# Altium schematic sheet Y9A-07-1517.SchDoc
size A4
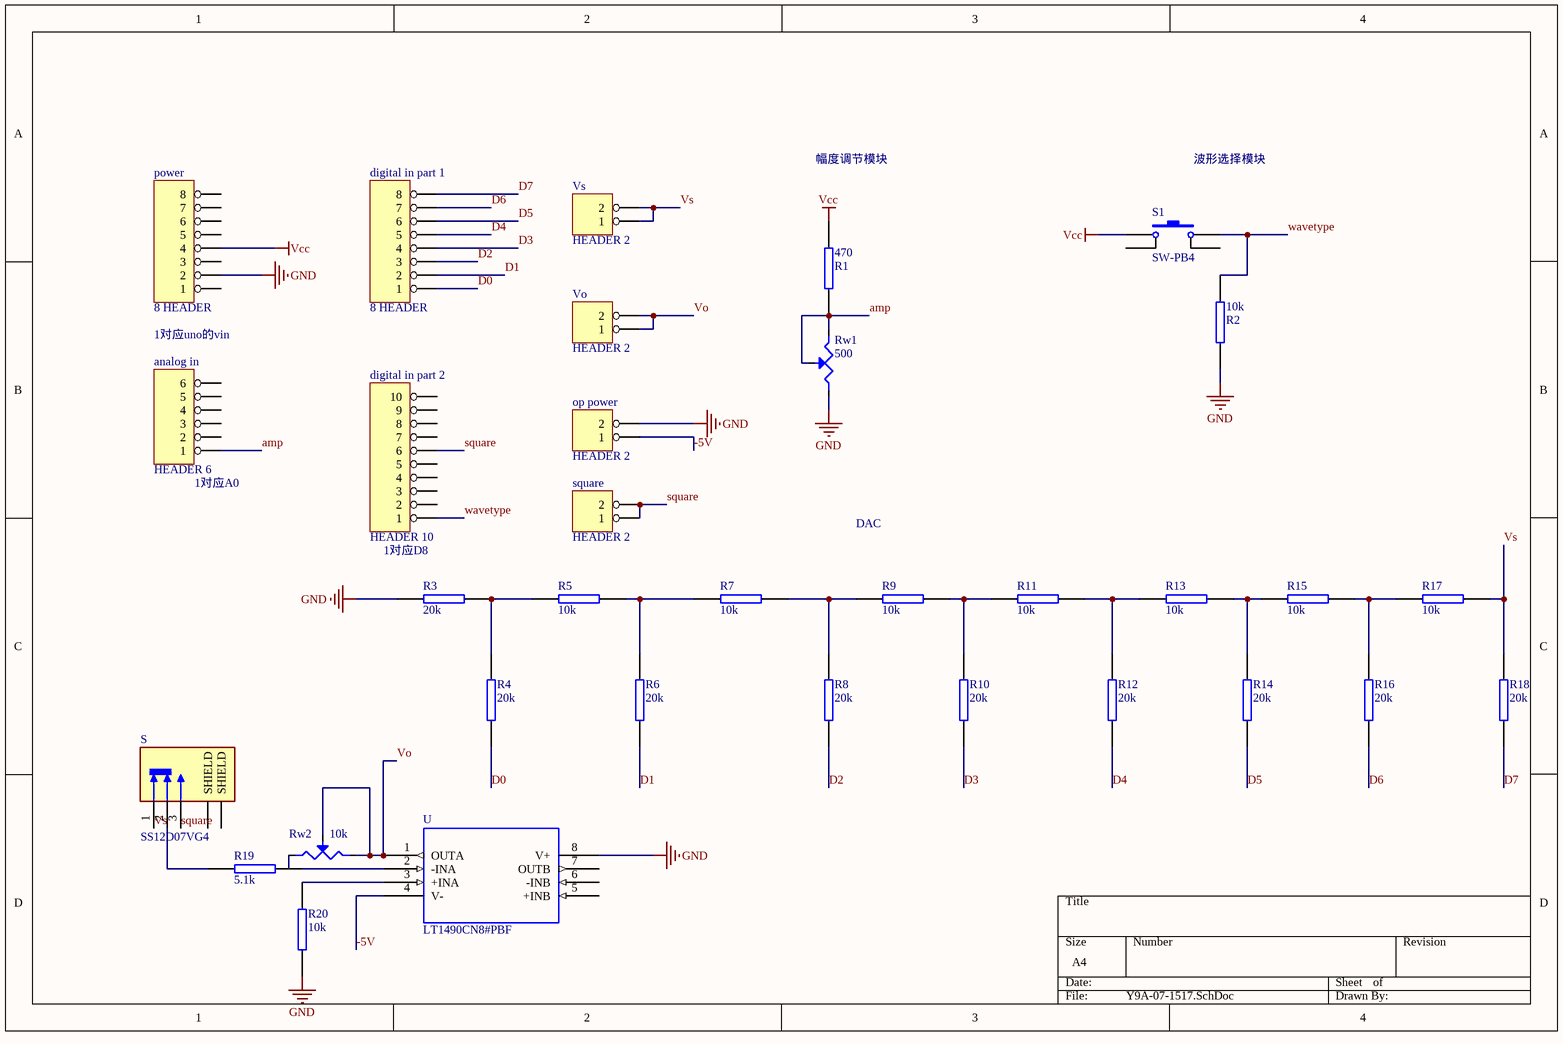
[diagram p0: Y9A-07-1517.SchDoc]

## Parts
10k  R2  [AXIAL-0.4]
470  R1  [AXIAL-0.4]
analog_in  HEADER 6  [SIP6]
digital_in_part_1  8 HEADER  [SIP8]
digital_in_part_2  HEADER 10  [SIP10]
op_power  HEADER 2  [POWER PLUG2]
power  8 HEADER  [SIP8]
R3  20k  [AXIAL-0.4]
R4  20k  [AXIAL-0.4]
R5  10k  [AXIAL-0.4]
R6  20k  [AXIAL-0.4]
R7  10k  [AXIAL-0.4]
R8  20k  [AXIAL-0.4]
R9  10k  [AXIAL-0.4]
R10  20k  [AXIAL-0.4]
R11  10k  [AXIAL-0.4]
R12  20k  [AXIAL-0.4]
R13  10k  [AXIAL-0.4]
R14  20k  [AXIAL-0.4]
R15  10k  [AXIAL-0.4]
R16  20k  [AXIAL-0.4]
R17  10k  [AXIAL-0.4]
R18  20k  [AXIAL-0.4]
R19  5.1k  [AXIAL-0.4]
R20  10k  [AXIAL-0.4]
Rw1  500  [VR5]
Rw2  10k  [VR5]
S  SS12D07VG4  [SW_SS12D07VG4]
S1  SW-PB4  [AN-S]
square  HEADER 2  [SIP-2]
U  LT1490CN8#PBF  [PDIP-8_N]
Vo  HEADER 2  [SIP-2]
Vs  HEADER 2  [SIP-2]

## Nets
GND: 10k.1 op_power.2 power.2 R3.1 R20.1 Rw1.1 U.8(V+)
Vcc: 470.2 power.4 S1.1
-5V: op_power.1 U.4(V-)
amp: 470.1 analog_in.1 Rw1.2 Rw1.3(W)
D0: digital_in_part_1.1 R4.1
D1: digital_in_part_1.2 R6.1
D2: digital_in_part_1.3 R8.1
D3: digital_in_part_1.4 R10.1
D4: digital_in_part_1.5 R12.1
D5: digital_in_part_1.6 R14.1
D6: digital_in_part_1.7 R16.1
D7: digital_in_part_1.8 R18.1
square: digital_in_part_2.6 S.3 square.1 square.2
Vo: Rw2.2 Rw2.3(W) U.1(OUTA) Vo.1 Vo.2
Vs: R17.2 R18.2 S.1 Vs.1 Vs.2
wavetype: 10k.2 digital_in_part_2.1 S1.2
NetR3_2: R3.2 R4.2 R5.1
NetR5_2: R5.2 R6.2 R7.1
NetR7_2: R7.2 R8.2 R9.1
NetR9_2: R9.2 R10.2 R11.1
NetR11_2: R11.2 R12.2 R13.1
NetR13_2: R13.2 R14.2 R15.1
NetR15_2: R15.2 R16.2 R17.1
NetR19_1: R19.1 S.2
NetR19_2: R19.2 U.2(-INA)
NetR20_2: R20.2 U.3(+INA)

Not connected (* = marked no-connect by the designer): analog_in 2 3 4 5 6; digital_in_part_2 2 3 4 5 7 8 9 10; power 1 3 5 6 7 8; Rw2 1; S S1(SHIELD) S2(SHIELD); S1 3 4; U 5(+INB) 6(-INB) 7(OUTB)

## Notes on the sheet
- 幅度调节模块
- 波形选择模块
- 1对应uno的vin
- (near analog_in) 1对应A0
- 1对应D8
- DAC

## Library data of the parts
10k R3-R20 = RES2
470 = RES2: value: 470
digital_in_part_1 power = HEADER 8: 8 Pin Header
Rw1 Rw2 = POT1: Potentiometer
S = SS12D07VG4: Switch Slide ON ON SPDT Top Slide 0.3A 30VDC PC Pins Bracket Mount/Through Hole Automotive Bulk; MF: Shouhan; SnapEDA_Link: https://www.snapeda.com/parts/SS12D07VG4/Shouhan/view-part/?ref=snap; Package: Package; Value: *; MP: SS12D07VG4; Check_prices: https://www.snapeda.com/parts/SS12D07VG4/Shouhan/view-part/?ref=eda
S1 = SW-PB4: 微动开关; Published: 24-Mar-1999; LatestRevisionDate: 17-Jul-2002; LatestRevisionNote: Re-released for DXP Platform.; PackageReference: SPST-2; Publisher: Altium Limited
U = LT1490CN8#PBF: Standard (General Purpose) Amplifier 2 Circuit Rail-to-Rail 8-PDIP; MF: Analog Devices; SnapEDA_Link: https://www.snapeda.com/parts/LT1490CN8%23PBF/Analog+Devices/view-part/?ref=snap; Package: PDIP-8 Linear Technology; Value: *; MP: LT1490CN8#PBF; Check_prices: https://www.snapeda.com/parts/LT1490CN8%23PBF/Analog+Devices/view-part/?ref=eda